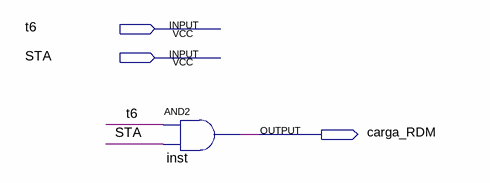
[diagram p0: schematic sheet]
// Quartus schematic carga_RDM.bdf as structural Verilog: 1 symbols, 3 pins
module carga_RDM (
  input  t6,
  input  STA,
  output carga_RDM
);

  and inst (carga_RDM, t6, STA);
endmodule
